# EAGLE design led-bike-suit-vest (EAGLE 9.6.2)
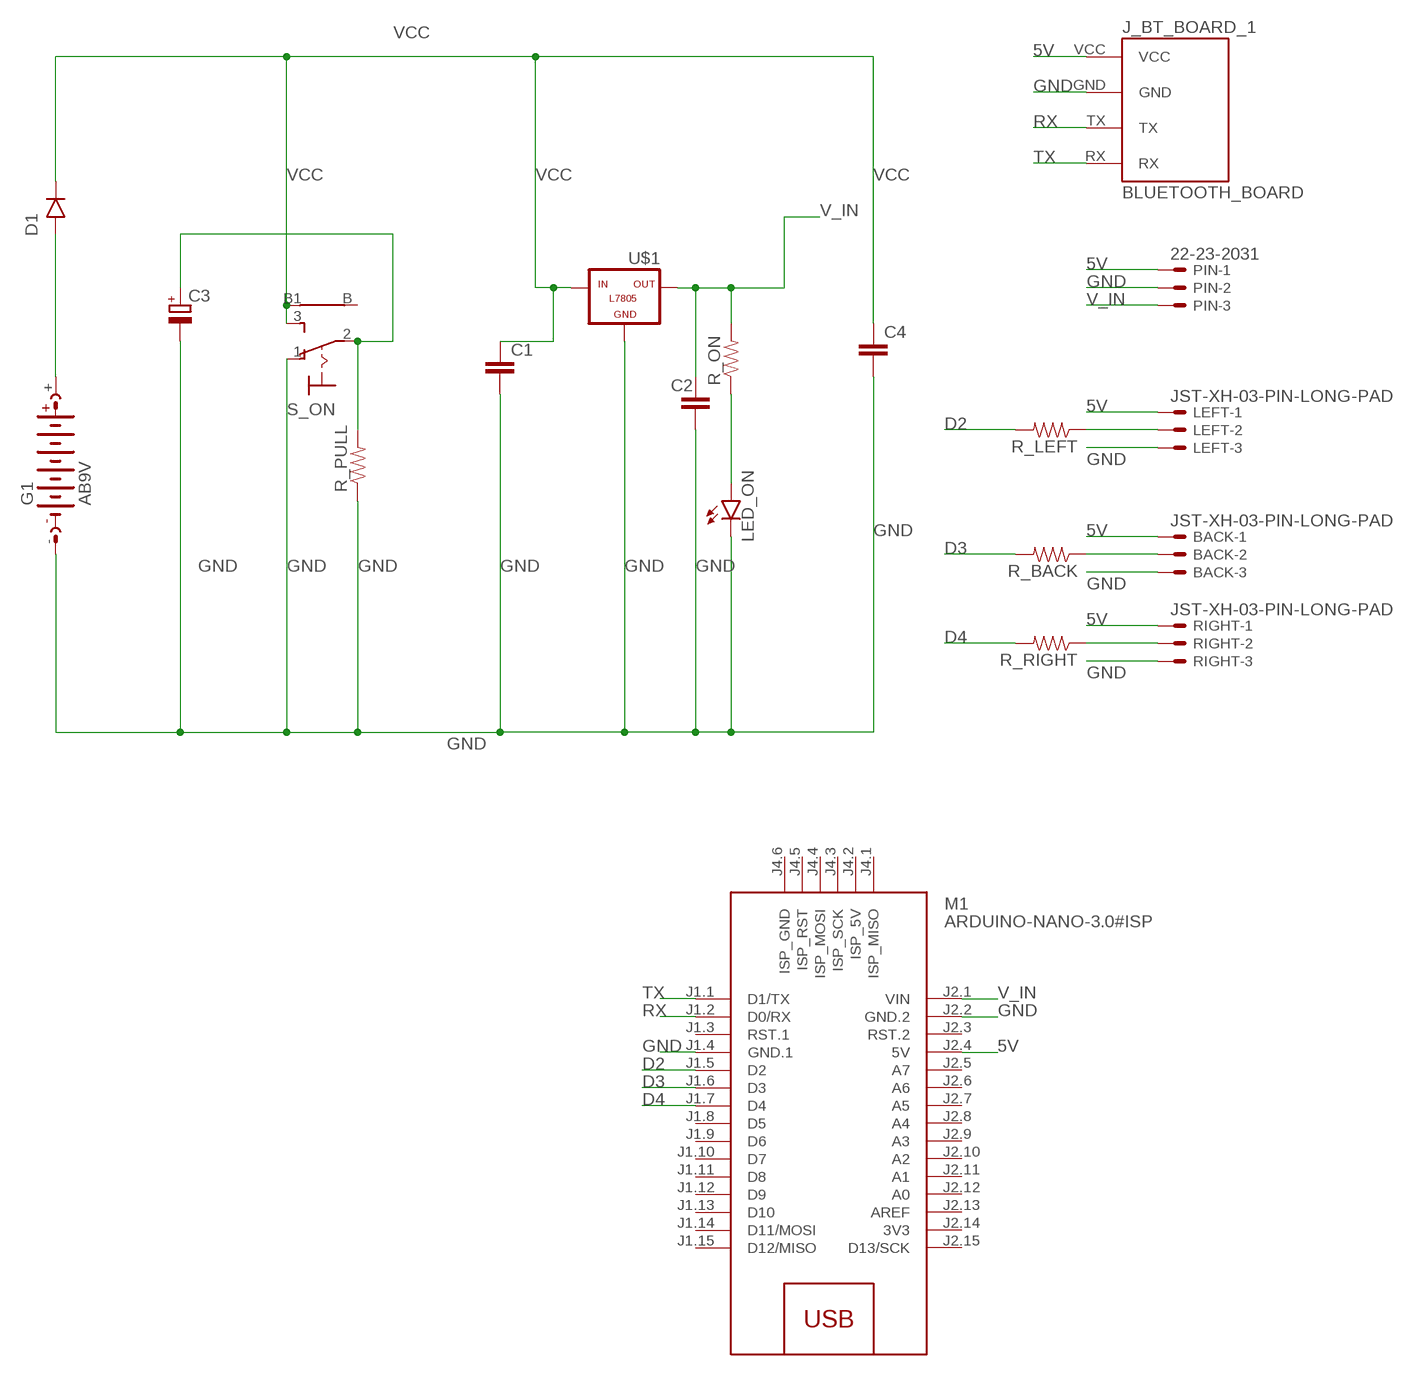
[diagram p0: schematic, sheet 1]

## Parts
BACK  JST-XH-03-PIN-LONG-PAD  [JST-XH-03-PACKAGE-LONG-PAD]
C1  C2.5/4  [C2.5-4]
C2  C2.5/4  [C2.5-4]
C3  RCL_CPOL-EUE3.5-8  [ELECTROLYTIC_CAP_RCL_E3,5-8]
C4  C2.5/4  [C2.5-4]
D1  1N4001  [DO41-10]
G1  AB9V  [AB9V]
J_BT_BOARD_1  BLUETOOTH_BOARD  [BT_BOARD_FOOTPRINT]
LED_ON  LED5MM  [LED5MM]
LEFT  JST-XH-03-PIN-LONG-PAD  [JST-XH-03-PACKAGE-LONG-PAD]
M1  ARDUINO-NANO-3.0#ISP  [ARDUINO-NANO-3.0#ISP]
PIN  22-23-2031  [22-23-2031]
R_BACK  PASSIVES_RESISTORPTH-1/4W  [SPARKFUN-PASSIVES_AXIAL-0.4]
R_LEFT  PASSIVES_RESISTORPTH-1/4W  [SPARKFUN-PASSIVES_AXIAL-0.4]
R_ON  PASSIVES_RESISTORPTH-1/4W  [SPARKFUN-PASSIVES_AXIAL-0.4]
R_PULL  PASSIVES_RESISTORPTH-1/4W  [SPARKFUN-PASSIVES_AXIAL-0.4]
R_RIGHT  PASSIVES_RESISTORPTH-1/4W  [SPARKFUN-PASSIVES_AXIAL-0.4]
RIGHT  JST-XH-03-PIN-LONG-PAD  [JST-XH-03-PACKAGE-LONG-PAD]
S_ON  9070-1W  [9070-1W]
U$1  -L7805  [L7805]

## Nets
5V: BACK.1 J_BT_BOARD_1.VCC LEFT.1 M1.J2.4(5V) PIN.1 RIGHT.1
D2: M1.J1.5(D2) R_LEFT.P$2
D3: M1.J1.6(D3) R_BACK.P$2
D4: M1.J1.7(D4) R_RIGHT.P$2
GND: BACK.3 C1.2 C2.2 C3.- C4.2 G1.- J_BT_BOARD_1.GND LED_ON.K(CATHODE) LEFT.3 M1.J1.4(GND.1) M1.J2.2(GND.2) PIN.2 R_PULL.P$1 RIGHT.3 S_ON.1(O) U$1.GND
N$1: BACK.2 R_BACK.P$1
N$3: LEFT.2 R_LEFT.P$1
N$5: R_RIGHT.P$1 RIGHT.2
N$11: C3.+ R_PULL.P$2 S_ON.2(P)
N$14: D1.A(ANODE) G1.+
N$16: LED_ON.A(ANODE) R_ON.P$1
RX: J_BT_BOARD_1.TX M1.J1.2(D0/RX)
TX: J_BT_BOARD_1.RX M1.J1.1(D1/TX)
V_IN: C2.1 M1.J2.1(VIN) PIN.3 R_ON.P$2 U$1.OUT
VCC: C1.1 C4.1 D1.C(CATHODE) S_ON.3(S) S_ON.B1 U$1.IN
Unconnected: M1.J1.3(RST.1) M1.J1.8(D5) M1.J1.9(D6) M1.J1.10(D7) M1.J1.11(D8) M1.J1.12(D9) M1.J1.13(D10) M1.J1.14(D11/MOSI) M1.J1.15(D12/MISO) M1.J2.3(RST.2) M1.J2.5(A7) M1.J2.6(A6) M1.J2.7(A5) M1.J2.8(A4) M1.J2.9(A3) M1.J2.10(A2) M1.J2.11(A1) M1.J2.12(A0) M1.J2.13(AREF) M1.J2.15(D13/SCK) M1.J4.1(ISP_MISO) M1.J4.2(ISP_5V) M1.J4.3(ISP_SCK) M1.J4.4(ISP_MOSI) M1.J4.5(ISP_RST) M1.J4.6(ISP_GND) S_ON.B

## Power pins joined to a net without a drawn wire
3V3: M1.J2.14(3V3)

## Library data of the parts
BACK LEFT RIGHT = Rembrandt Electronics - JST XH Connectors v1-0:JST-XH-03-PIN: JST XH Connector 2 Pin Wire to board connector. Pitch: 2,54 mm, (0.100") Number of pins: 3 Created by Rembrandt Electronics www.rembrandtelectronics.com
C1 C2 C4 = capacitor-wima:C: CAPACITOR naming: grid - package width
C3 = EL311:RCL_CPOL-EU: POLARIZED CAPACITOR, European symbol
D1 = tango:1N4001: DIODE general purpose rectifier, 1 A
G1 = battery:AB9V: 9-V BATTERY CLIP
J_BT_BOARD_1 = Bluetooth HC-05:BLUETOOTH_BOARD: Bluetooth Board V1.05
LED_ON = tango:LED: LED OSRAM: - CHIPLED LG R971, LG N971, LY N971, LG Q971, LY Q971, LO R971, LY R971 LH N974, LH R974 LS Q976, LO Q976, LY Q976 LO Q996 - Hyper CHIPLED LW Q18S LB Q993, LB Q99A, LB R99A - SideLED LS A670, LO A670, LY A670, LG A670, LP A670 LB A673, LV A673, LT A673, LW A673 LH A674 LY A675 LS A676, LA A676, LO A676, LY A676, LW A676 LS A679, LY A679, LG A679 - Hyper Micro SIDELED® LS Y876, LA Y876, LO Y876, LY Y876 LT Y87S - SmartLED LW L88C, LW L88S LB L89C, LB L89S, LG L890 LS L89K, LO L89K, LY L89K LS L896, LA L896, LO L896, LY L896 - TOPLED LS T670, LO T670, LY T670, LG T670, LP T670 LSG T670, LSP T670, LSY T670, LOP T670, LYG T670 LG T671, LOG T671, LSG T671 LB T673, LV T673, LT T673, LW T673 LH T674 LS T676, LA T676, LO T676, LY T676, LB T676, LH T676, LSB T676, LW T676 LB T67C, LV T67C, LT T67C, LS T67K, LO T67K, LY T67K, LW E67C LS E67B, LA E67B, LO E67B, LY E67B, LB E67C, LV E67C, LT E67C LW T67C LS T679, LY T679, LG T679 LS T770, LO T770, LY T770, LG T770, LP T770 LB T773, LV T773, LT T773, LW T773 LH T774 LS E675, LA E675, LY E675, LS T675 LS T776, LA T776, LO T776, LY T776, LB T776 LHGB T686 LT T68C, LB T68C - Hyper Mini TOPLED® LB M676 - Mini TOPLED Santana® LG M470 LS M47K, LO M47K, LY M47K Source: http://www.osram.convergy.de - LUMILED® LXK2-PW12-R00, LXK2-PW12-S00, LXK2-PW14-U00, LXK2-PW14-V00 LXK2-PM12-R00, LXK2-PM12-S00, LXK2-PM14-U00 LXK2-PE12-Q00, LXK2-PE12-R00, LXK2-PE12-S00, LXK2-PE14-T00, LXK2-PE14-U00 LXK2-PB12-K00, LXK2-PB12-L00, LXK2-PB12-M00, LXK2-PB14-N00, LXK2-PB14-P00, LXK2-PB14-Q00 LXK2-PR12-L00, LXK2-PR12-M00, LXK2-PR14-Q00, LXK2-PR14-R00 LXK2-PD12-Q00, LXK2-PD12-R00, LXK2-PD12-S00 LXK2-PH12-R00, LXK2-PH12-S00 LXK2-PL12-P00, LXK2-PL12-Q00, LXK2-PL12-R00 Source: www.luxeon.com
M1 = diy-modules:ARDUINO-NANO-3.0#ISP: Arduino Nano 3.0 (and compatible devices) with ISP pads More details available here: https://www.arduino.cc/en/Main/ArduinoBoardNano Click here to find device on ebay.com <http://www.ebay.com/sch/arduino+nano>
PIN = con-molex:22-23-2031: .100" (2.54mm) Center Header - 3 Pin; MF: MOLEX; MPN: 22-23-2031; OC_FARNELL: 1462950; OC_NEWARK: 30C0862
R_BACK R_LEFT R_ON R_PULL R_RIGHT = EL311:PASSIVES_RESISTOR: Resistor Basic schematic elements and footprints for 0603, 1206, and PTH resistors.
S_ON = switch:9070-1W: TOGGLE SWITCH Marquardt
U$1 = tango:-L7805

## Board
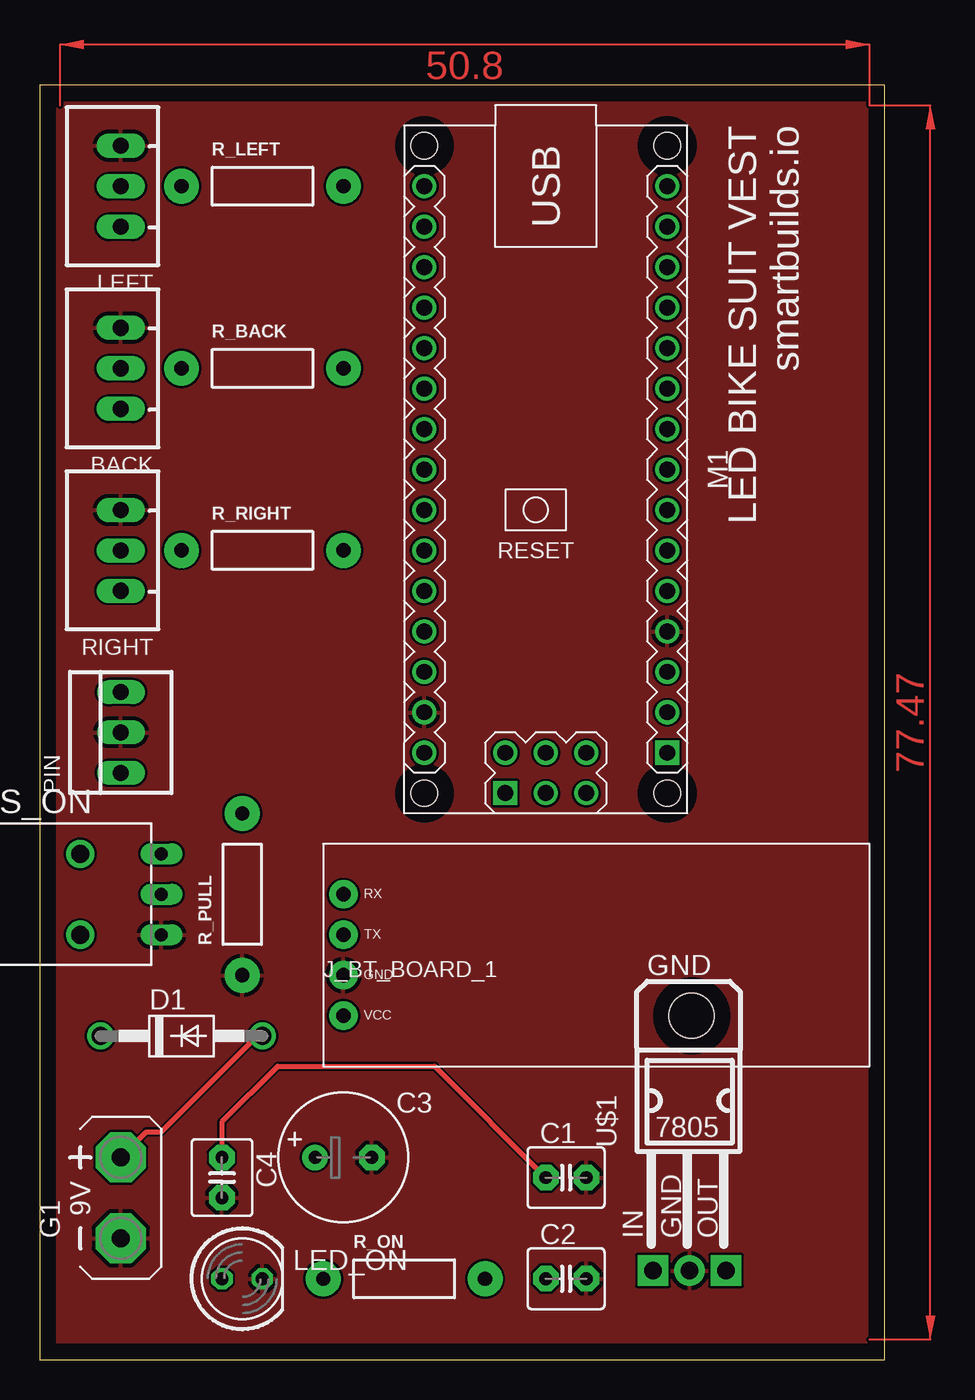
[diagram p1: board, top side]
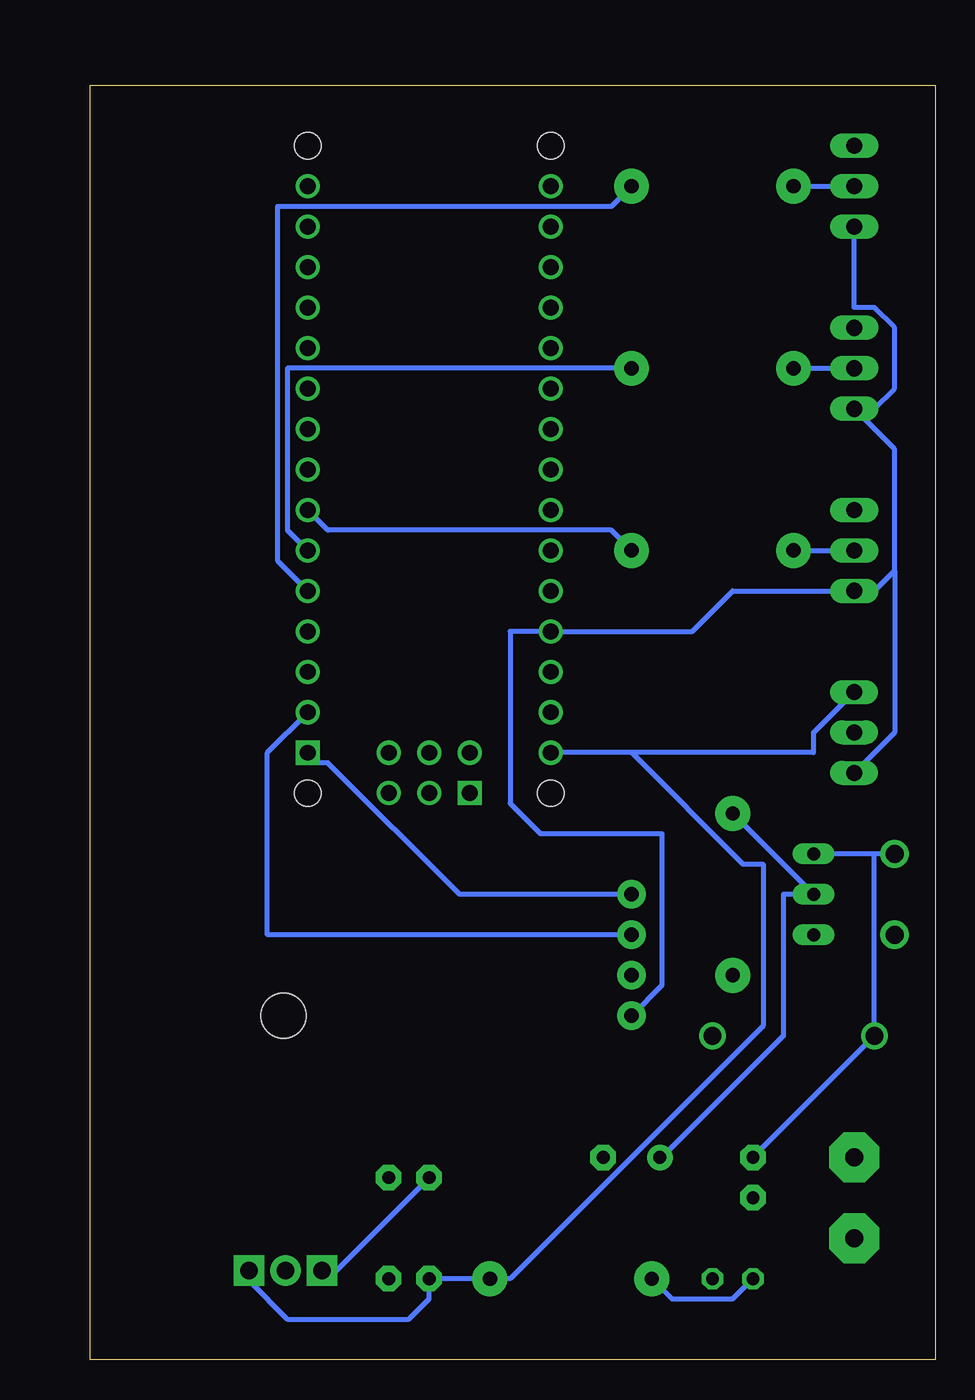
[diagram p2: board, bottom side, seen from below]

Size 53.01 x 80 mm. Coordinates in mm from the lower left corner, seen from the top.
Outline: 0,0 53.01,0 53.01,80 0,80 0,0
Copper layers (1*16): Top 0.035mm / dielectric 1.5mm / Bottom 0.035mm
Design rules "default *": minimum track width 12mil, minimum drill 20mm, track to track 6mil, track to pad 6mil, pad to pad 6mil, via to via 6mil, smd to smd 6mil, copper to edge 40mil, drill to drill 6mil, minimum pad ring 10mil, minimum via ring 8mil, stop-mask expansion 4mil, vias tented up to drill 0mil, thermal gap 10mil

### Footprints (pad centres in the part's own frame; a part is rotated, then mirrored left to right if it is on the bottom)
JST-XH-03-PACKAGE-LONG-PAD = drill 1.016 long: 1 -2.54,0; 2 0,0; 3 2.54,0
C2.5-4 = drill 0.813 pad 1.6 octagon: 1 -1.27,0; 2 1.27,0
ELECTROLYTIC_CAP_RCL_E3,5-8 = drill 0.813 pad 1.6: + -1.778,0 | drill 0.813 pad 1.6 octagon: - 1.778,0
DO41-10 = drill 1.118: A 5.08,0; C -5.08,0
AB9V = drill 1.118 pad 3.15 octagon: + 0,2.54; - 0,-2.54
BT_BOARD_FOOTPRINT = drill 0.9 pad 1.778: GND -16.51,-1.27; RX -16.51,3.81; TX -16.51,1.27; VCC -16.51,-3.81
LED5MM = drill 0.813 octagon: A -1.27,0; K 1.27,0
ARDUINO-NANO-3.0#ISP = drill 1 square: J1.1 17.78,7.62; J4.1 20.32,-2.54 | drill 1: J1.2 15.24,7.62; J1.3 12.7,7.62; J1.4 10.16,7.62; J1.5 7.62,7.62; J1.6 5.08,7.62; J1.7 2.54,7.62; J1.8 0,7.62; J1.9 -2.54,7.62; J1.10 -5.08,7.62; J1.11 -7.62,7.62; J1.12 -10.16,7.62; J1.13 -12.7,7.62; J1.14 -15.24,7.62; J1.15 -17.78,7.62; J2.1 17.78,-7.62; J2.2 15.24,-7.62; J2.3 12.7,-7.62; J2.4 10.16,-7.62; J2.5 7.62,-7.62; J2.6 5.08,-7.62; J2.7 2.54,-7.62; J2.8 0,-7.62; J2.9 -2.54,-7.62; J2.10 -5.08,-7.62; J2.11 -7.62,-7.62; J2.12 -10.16,-7.62; J2.13 -12.7,-7.62; J2.14 -15.24,-7.62; J2.15 -17.78,-7.62; J4.2 17.78,-2.54; J4.3 20.32,0; J4.4 17.78,0; J4.5 20.32,2.54; J4.6 17.78,2.54 | hole 1.651: -20.32,7.62; -20.32,-7.62; 20.32,-7.62; 20.32,7.62
22-23-2031 = drill 1 long: 1 -2.54,0; 2 0,0; 3 2.54,0
SPARKFUN-PASSIVES_AXIAL-0.4 = drill 0.9 pad 2.184: P$1 -5.08,0; P$2 5.08,0
9070-1W = drill 0.813 long: 1 5.08,-2.54; 2 5.08,0; 3 5.08,2.54 | drill 1.118 pad 1.778: B 0,-2.54; B1 0,2.54
L7805 = drill 1.1 pad 1.93: GND 0.127,-9.652 | drill 1.1 pad 1.93 square: IN -2.159,-9.652; OUT 2.413,-9.652 | hole 2.8: 0.254,6.35

### Placement (x,y rotation side)
BACK  5.08,62.23 90 top
C1  33.02,11.43 0 top
C2  33.02,5.08 0 top
C3  19.05,12.7 0 top
C4  11.43,11.43 270 top
D1  8.89,20.32 0 top
G1  5.08,10.16 0 top
J_BT_BOARD_1  35.56,25.4 0 top
LED_ON  12.7,5.08 0 top
LEFT  5.08,73.66 90 top
M1  31.75,55.88 270 top
PIN  5.08,39.37 90 top
R_BACK  13.97,62.23 0 top
R_LEFT  13.97,73.66 0 top
R_ON  22.86,5.08 0 top
R_PULL  12.7,29.21 90 top
R_RIGHT  13.97,50.8 0 top
RIGHT  5.08,50.8 90 top
S_ON  2.54,29.21 0 top
U$1  40.64,15.24 0 top

### Tracks (layer width: path | path; a pad name or v marks a point on that pad's centre or on a via)
5V
  Bottom 0.305: 2.54,49.53 3.81,48.26 RIGHT.1 12.7,48.26 15.24,45.72 M1.J2.4 26.67,45.72 26.67,34.92 24.77,33.02 17.14,33.02 17.14,23.5 J_BT_BOARD_1.VCC | 2.54,49.53 2.54,57.15 BACK.1 3.81,59.69 2.54,60.96 2.54,64.77 3.81,66.04 5.08,66.04 LEFT.1 | PIN.1 2.54,39.37 2.54,49.53
D2
  Bottom 0.305: M1.J1.5 41.27,50.16 41.27,72.39 20.32,72.39 R_LEFT.P$2
D3
  Bottom 0.305: M1.J1.6 40.64,52.07 40.64,62.23 R_BACK.P$2
D4
  Bottom 0.305: M1.J1.7 38.1,52.07 20.32,52.07 R_RIGHT.P$2
GND
  pour Top: -1.27,81.28 -1.27,-1.27 54.61,-1.27 54.61,81.28
N$1
  Bottom 0.305: R_BACK.P$1 BACK.2
N$3
  Bottom 0.305: R_LEFT.P$1 LEFT.2
N$5
  Bottom 0.305: R_RIGHT.P$1 RIGHT.2
N$11
  Bottom 0.305: R_PULL.P$2 S_ON.2 9.53,29.21 9.53,20.32 17.14,12.7 C3.+
N$14
  Top 0.305: D1.A 13.65,20.32 7.62,14.29 6.67,14.29 G1.+
N$16
  Bottom 0.305: LED_ON.A 12.7,3.81 16.51,3.81 R_ON.P$1
RX
  Bottom 0.305: M1.J1.2 41.91,38.1 41.91,26.67 J_BT_BOARD_1.TX
TX
  Bottom 0.305: M1.J1.1 38.73,37.47 38.1,37.47 29.84,29.21 J_BT_BOARD_1.RX
V_IN
  Bottom 0.305: PIN.3 7.62,39.37 7.62,38.1 19.05,38.1 | 19.05,38.1 M1.J2.1 | 19.05,38.1 12.06,31.11 10.79,31.11 10.79,20.95 26.67,5.08 R_ON.P$2 C2.1 31.75,3.81 33.02,2.54 40.64,2.54 43.05,4.95 U$1.OUT
VCC
  Top 0.305: C1.1 24.77,18.41 14.92,18.41 11.43,14.92 C4.1
  Bottom 0.305: C1.1 38.19,5 U$1.IN | S_ON.B1 3.81,31.75 | 3.81,31.75 S_ON.3 | C4.1 D1.C 3.81,31.75
(copper drawn outside any net)
  shapes: Top area x2

### Text on the board
tPlace: LED BIKE SUIT VEST / smartbuilds.io